# EAGLE design EDCPSU_M2_Jack v1 (EAGLE 9.6.2)
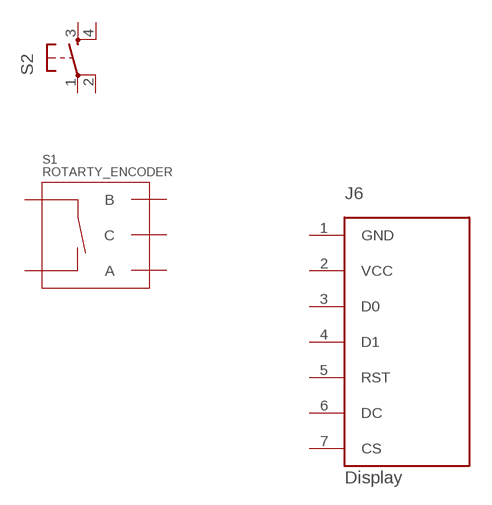
[diagram p0: schematic, sheet 1, part 1 of 2]
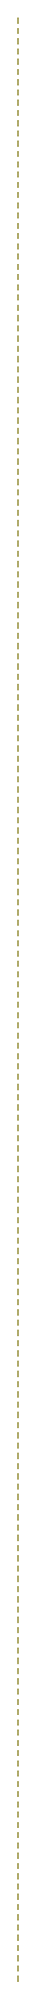
[diagram p1: schematic, sheet 1, part 2 of 2]

## Parts
J6  Display  OLED_LCD  [OLED_LCD]
S1  ROTARTY_ENCODER  [ROTARY_ENC_PLAIN]
S2  TAC_SWITCH_KSC931G-SMD  [TAC_SW_SMD_KSC931G]
Unconnected: J6.1(GND) J6.2(VCC) J6.3(D0) J6.4(D1) J6.5(RST) J6.6(DC) J6.7(CS) S1.A S1.B S1.C S1.SW+ S1.SW- S2.1 S2.2 S2.3 S2.4

## Library data of the parts
J6 = EDCPSU:OLED_LCD
S1 = SparkFun-Electromechanical:ROTARTY_ENCODER: Simple no LED rotary encoder Example: COM-09117
S2 = EDCPSU - Rev2:TAC_SWITCH: Momentary Switch Button commonly used for reset or general input. Spark Fun Electronics SKU : COM-00097 SMT- SWCH-08247

## Net classes
1 vcc: width 0.254 mm

## Board
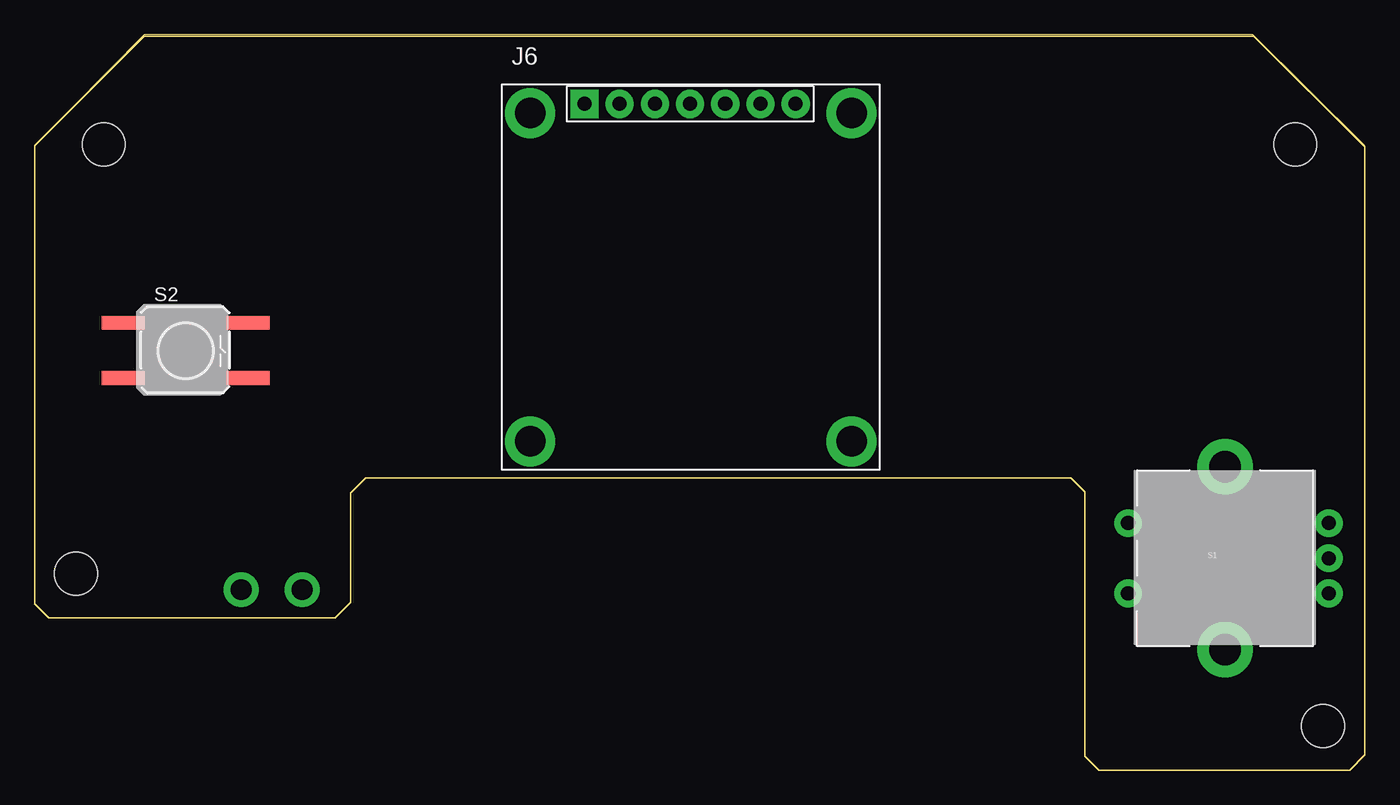
[diagram p2: board, top side]

Size 96 x 53.1 mm. Coordinates in mm from the lower left corner, seen from the top.
Outline: 96,45.1 87.9,53.1 7.9,53.1 0,45.1
Outline: 0,45.1 7.9,53 88,53 96,45 96,1.1 94.9,0 76.8,0 75.8,1 75.8,20.1 74.8,21.1 23.9,21.1 22.8,20 22.8,12.1 21.7,11 1,11 0,12 0,45.1
Copper layers (1*2*15*16): Top 0.035mm / dielectric 0.2mm / GND 0.0175mm / dielectric 0.3mm / PWR 0.0175mm / dielectric 0.2mm / Bottom 0.035mm
Design rules "SeeedStudio_4layer_DRU_no_angle_20140221 *": minimum track width 8mil, minimum drill 12mil, track to track 8mil, track to pad 8mil, pad to pad 8mil, via to via 8mil, smd to smd 0mil, copper to edge 10mil, drill to drill 8mil, minimum pad ring 6mil, minimum via ring 4mil, stop-mask expansion 4mil, vias tented up to drill 25mil, thermal gap 10mil
Holes 3.1 mm at 4.98,45.18 90.98,45.18 2.98,14.18 92.98,3.18

### Footprints (pad centres in the part's own frame; a part is rotated, then mirrored left to right if it is on the bottom)
OLED_LCD = drill 1.016 pad 2.032 square: 1 -7.42,13.7 | drill 1.016 pad 2.032: 2 -4.88,13.7; 3 -2.34,13.7; 4 0.2,13.7; 5 2.74,13.7; 6 5.28,13.7; 7 7.82,13.7 | drill 2.2 pad 3.6: M1 -11.34,13.04; M2 11.86,13.04; M3 11.86,-10.66; M4 -11.34,-10.66
ROTARY_ENC_PLAIN = drill 1.016 pad 2: A 7.493,-2.54; B 7.493,2.54; C 7.493,0; SW+ -6.985,2.54; SW- -6.985,-2.54 | drill 2.286 pad 4: P$3 0,6.604; P$4 0,-6.604
TAC_SW_SMD_KSC931G = smd 3.1 x 1: 1 -4.5,2; 2 4.5,2; 3 -4.5,-2; 4 4.5,-2

### Placement (x,y rotation side)
J6  47.1,34.4 0 top
S1  85.9,15.3 0 top
S2  10.9,30.3 0 top

### Tracks (layer width: path | path; a pad name or v marks a point on that pad's centre or on a via)
GND  (via drill 1.5 pad 2.5)
  other vias: 14.9,13.04
GND1  (via drill 1.5 pad 2.5)
  other vias: 19.3,13.04